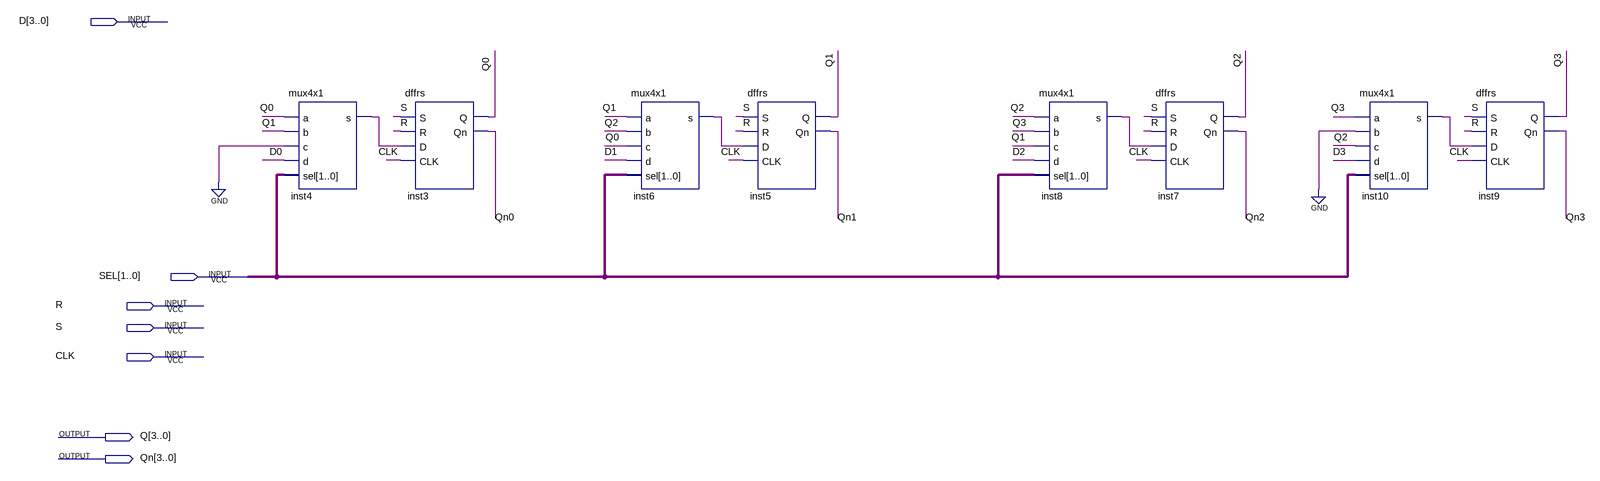
[diagram p0: schematic sheet]
// Quartus schematic shiftreg4bits.bdf as structural Verilog: 8 symbols, 7 pins
module shiftreg4bits (
  input  [3:0] D,
  input  [1:0] SEL,
  input  R,
  input  S,
  input  CLK,
  output [3:0] Q,
  output [3:0] Qn
);

  wire inst4_s, inst6_s, inst8_s, inst10_s;

  mux4x1 inst4 (.a(Q[0]), .b(Q[1]), .c(1'b0), .d(D[0]), .sel(SEL), .s(inst4_s));
  dffrs inst3 (.S(S), .R(R), .D(inst4_s), .CLK(CLK), .Q(Q[0]), .Qn(Qn[0]));
  mux4x1 inst6 (.a(Q[1]), .b(Q[2]), .c(Q[0]), .d(D[1]), .sel(SEL), .s(inst6_s));
  dffrs inst5 (.S(S), .R(R), .D(inst6_s), .CLK(CLK), .Q(Q[1]), .Qn(Qn[1]));
  mux4x1 inst8 (.a(Q[2]), .b(Q[3]), .c(Q[1]), .d(D[2]), .sel(SEL), .s(inst8_s));
  dffrs inst7 (.S(S), .R(R), .D(inst8_s), .CLK(CLK), .Q(Q[2]), .Qn(Qn[2]));
  mux4x1 inst10 (.a(Q[3]), .b(1'b0), .c(Q[2]), .d(D[3]), .sel(SEL), .s(inst10_s));
  dffrs inst9 (.S(S), .R(R), .D(inst10_s), .CLK(CLK), .Q(Q[3]), .Qn(Qn[3]));
endmodule
